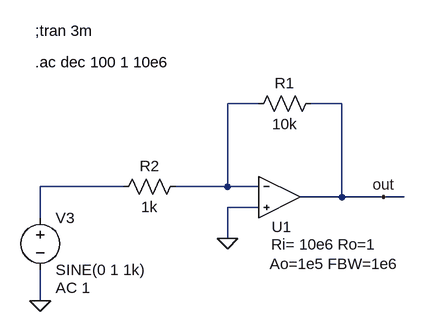
[diagram p0: schematic TestMyOpamp.asc]
TestMyOpamp.asc, the LTspice schematic file:
Version 4
SHEET 1 880 680
WIRE 224 0 176 0
WIRE 352 0 304 0
WIRE 16 128 -112 128
WIRE 176 128 176 0
WIRE 176 128 96 128
WIRE 224 128 176 128
WIRE 352 144 352 0
WIRE 352 144 288 144
WIRE 416 144 352 144
WIRE 448 144 416 144
WIRE 224 160 176 160
WIRE -112 176 -112 128
WIRE 176 208 176 160
WIRE -112 304 -112 256
FLAG 176 208 0
FLAG 416 144 out
FLAG -112 304 0
SYMBOL res 320 -16 R90
WINDOW 0 0 56 VBottom 2
WINDOW 3 32 56 VTop 2
SYMATTR InstName R1
SYMATTR Value 10k
SYMBOL res 112 112 R90
WINDOW 0 0 56 VBottom 2
WINDOW 3 32 56 VTop 2
SYMATTR InstName R2
SYMATTR Value 1k
SYMBOL voltage -112 160 R0
WINDOW 123 24 124 Left 2
WINDOW 39 0 0 Left 0
SYMATTR Value2 AC 1
SYMATTR InstName V3
SYMATTR Value SINE(0 1 1k)
SYMBOL MyOpamp 256 144 M180
WINDOW 39 69 -73 Center 2
WINDOW 40 84 -103 Center 2
SYMATTR InstName U1
TEXT -120 -112 Left 2 !;tran 3m
TEXT -120 -64 Left 2 !.ac dec 100 1 10e6

The netlist it stands for:
* TestMyOpamp.asc
R1 out N001 10k
R2 N001 N002 1k
V3 N002 0 SINE(0 1 1k) AC 1
XU1 0 N001 out MyOpamp Ri= 10e6 Ro=1 Ao=1e5 FBW=1e6  ; pins 1 2 3
;tran 3m
.ac dec 100 1 10e6
.lib MyOpamp.sub
.backanno
.end